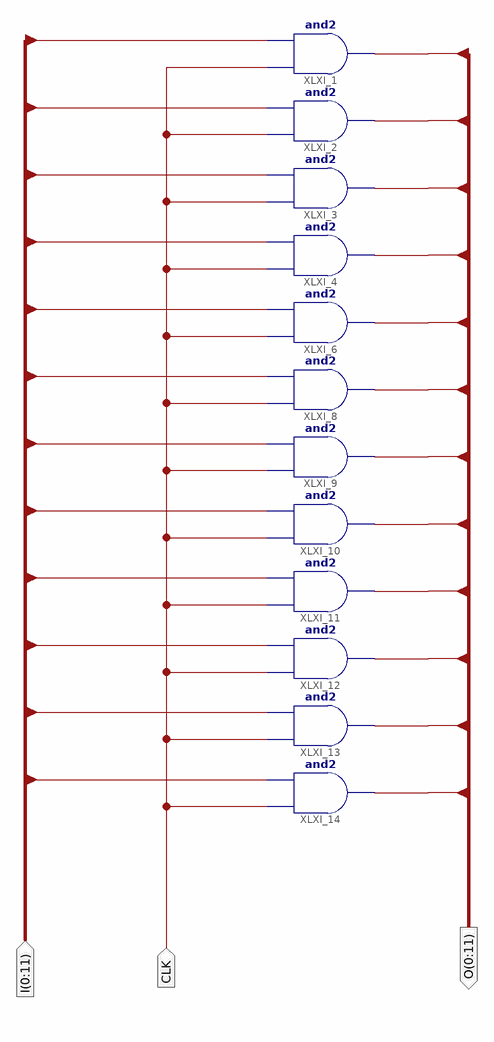
[diagram p0: schematic sheet 1]
// Xilinx ISE schematic DecoderInput.sch (spartan3e) as structural Verilog: 12 symbols, 3 ports
module DecoderInput (
  input  [0:11] I,
  input  CLK,
  output [0:11] O
);

  and XLXI_1 (O[0], CLK, I[0]);
  and XLXI_2 (O[1], CLK, I[1]);
  and XLXI_3 (O[2], CLK, I[2]);
  and XLXI_4 (O[3], CLK, I[3]);
  and XLXI_6 (O[4], CLK, I[4]);
  and XLXI_8 (O[5], CLK, I[5]);
  and XLXI_9 (O[6], CLK, I[6]);
  and XLXI_10 (O[7], CLK, I[7]);
  and XLXI_11 (O[8], CLK, I[8]);
  and XLXI_12 (O[9], CLK, I[9]);
  and XLXI_13 (O[10], CLK, I[10]);
  and XLXI_14 (O[11], CLK, I[11]);
endmodule
